# Altium project ArduinoZeroV4.0.PrjPcb
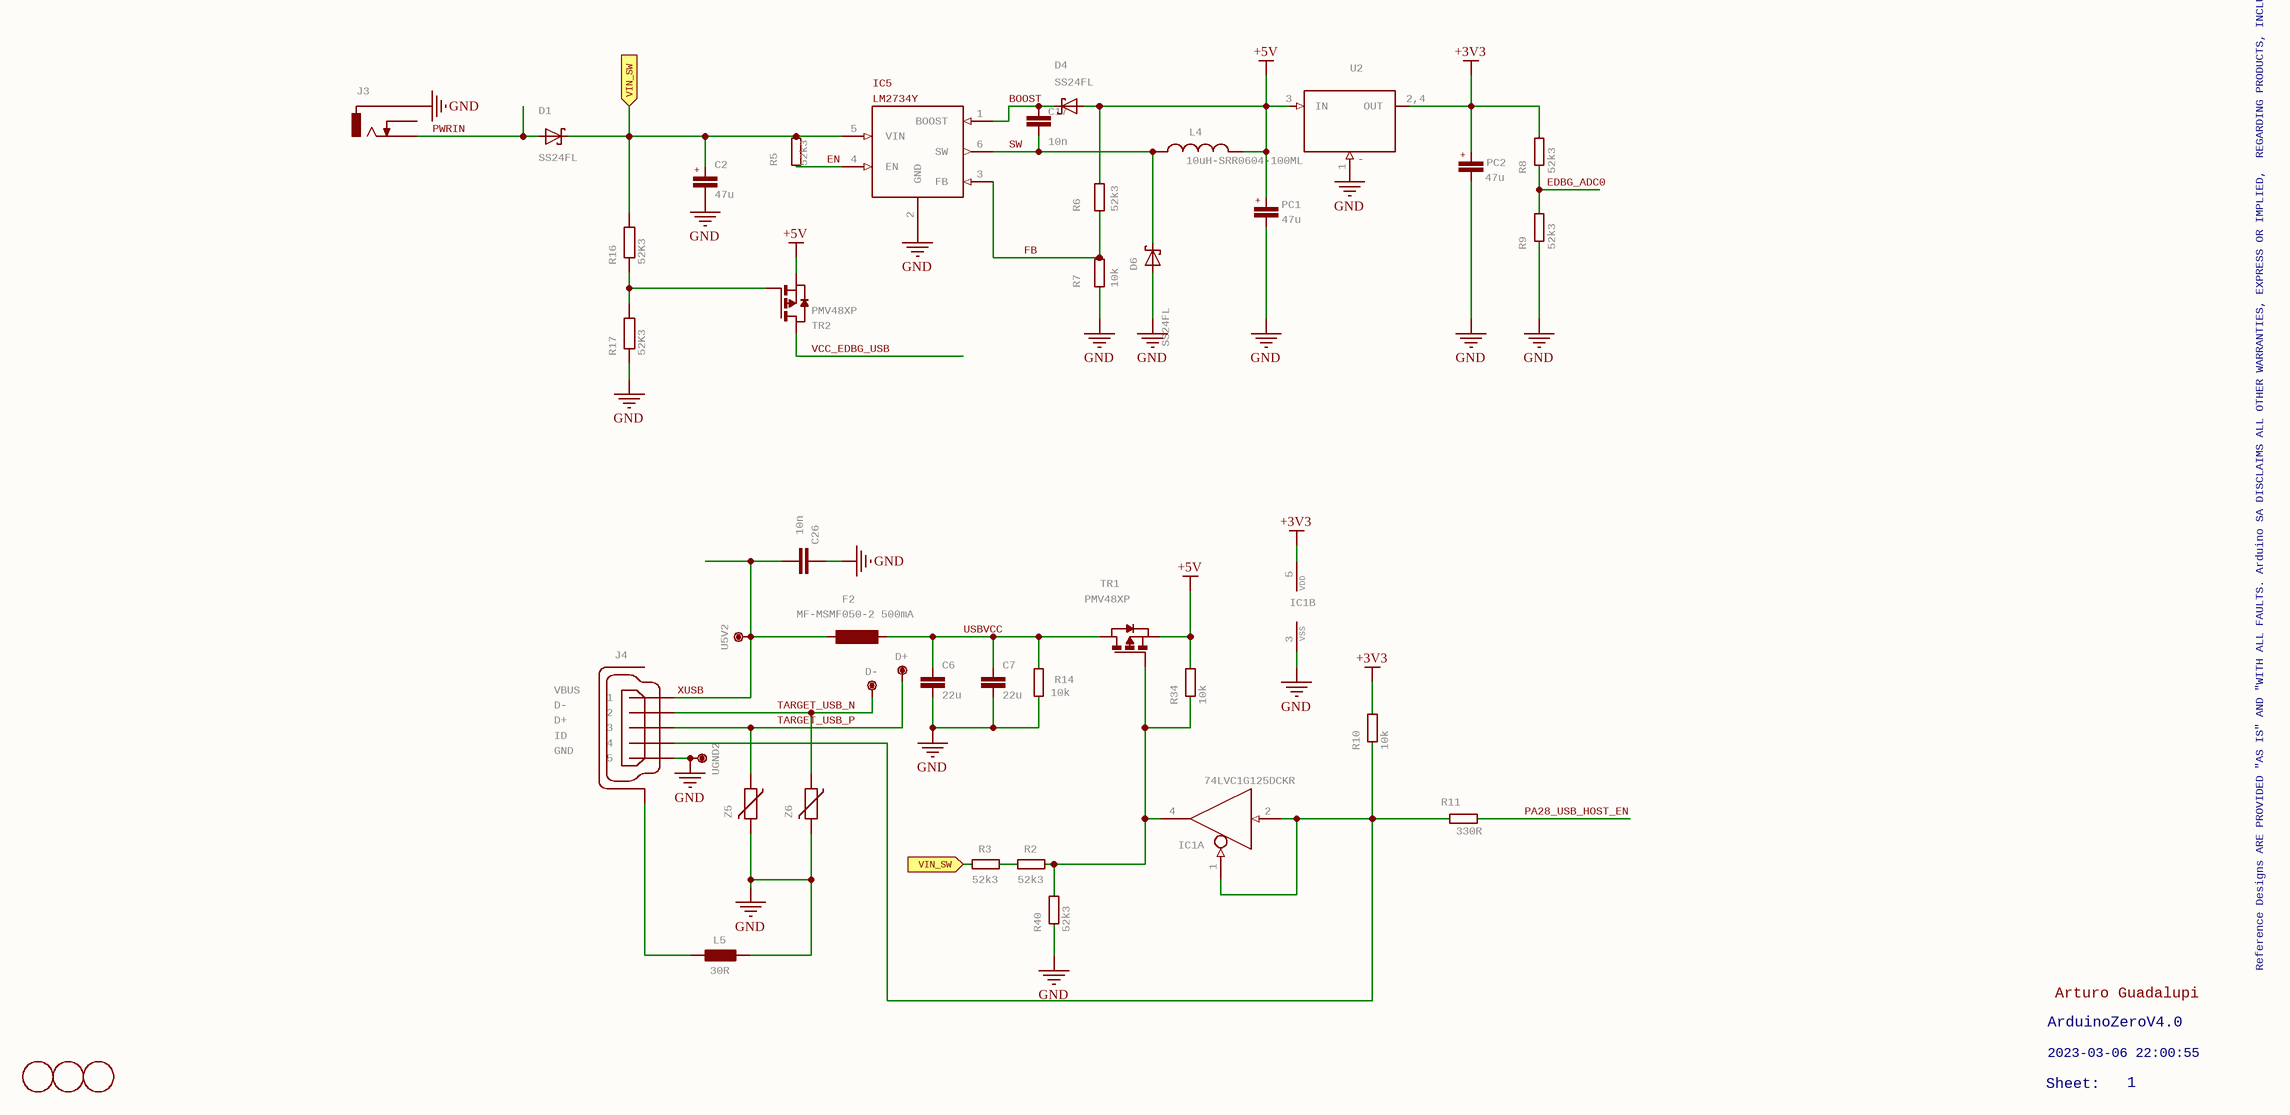
[diagram p0: ArduinoZeroV4.0_0.SchDoc]
2 sheets, 72 parts. Net scope: flat (ports and power ports of the same name join across sheets).
Board file: ArduinoZeroV4.0.PcbDoc
Sheets:
  ArduinoZeroV4.0_0.SchDoc
  ArduinoZeroV4.0_1.SchDoc

## Sheet ArduinoZeroV4.0_0.SchDoc: ArduinoZeroV4.0
size 409 x 289 mm; Origin: Eagle; Date: 2023-03-06 22:00:55; SheetNumber: 1; CODE-ARDUINO: DNP; DATASHEET: DNP; DISTRIBUTOR-LINK: DNP; DISTRIBUTOR-PN: DNP; MANUFACTURER: DNP; MANUFACTURER-PN: DNP; NOTE: DNP; Value: DNP; GateName_1: G$1; SymbolName_1: A3L-LOC; LibraryName: Arduino-utility; DeviceSetName: A3-FRAME; Sheet: Sheet:; ReferenceDesignsAREPROVIDED"ASIS"AND"WITHALLFAULTS.ArduinoSADISCLAIMSALLOTHERWARRANTIES,EXPRESSORIMPLIED,
REGARDINGPRODUCTS,INCLUDINGBUTNOTLIMITEDTO,ANYIMPLIEDWARRANTIESOFMERCHANTABILITYORFITNESSFORAPARTICULARPURPOSE

ArduinoSAmaymakechangestospecificationsandproductdescriptionsatanytime,withoutnotice.TheCustomermustnot
relyontheabsenceorcharacteristicsofanyfeaturesorinstructionsmarked"reserved"or"undefined."ArduinoSAreserves
theseforfuturedefinitionandshallhavenoresponsibilitywhatsoeverforconflictsorincompatibilitiesarisingfromfuturechangestothem.
TheproductinformationontheWebSiteorMaterialsissubjecttochangewithoutnotice.Donotfinalizeadesignwiththisinfo

ARDUINOandotherArduinobrandsandlogosandTrademarksofArduinoSA.AllArduinoSATrademarkscannotbeusedwithoutowner'sformalpermission: Reference Designs ARE PROVIDED "AS IS" AND "WITH ALL FAULTS. Arduino SA DISCLAIMS ALL OTHER WARRANTIES, EXPRESS OR IMPLIED, / REGARDING PRODUCTS, INCLUDING BUT NOT LIMITED TO, ANY IMPLIED WARRANTIES OF MERCHANTABILITY OR FITNESS FOR A PARTICULAR PURPOSE / Arduino SA may make changes to specifications and product descriptions at any time, without notice. The Customer must not / rely on the absence or characteristics of any features or instructions marked "reserved" or "undefined." Arduino SA reserves / these for future definition and shall have no responsibility whatsoever for conflicts or incompatibilities arising from future changes to them. / The product information on the Web Site or Materials is subject to change without notice. Do not finalize a design with this info / ARDUINO and other Arduino brands and logos and Trademarks of Arduino SA. All Arduino SA Trademarks cannot be used without owner's formal permission

### Parts
C2  47u  [PANASONIC_D]
C6  22u  [0805-R2013X50N]
C7  22u  [0805-R2013X50N]
C17  10n  [0603-1608X90N]
C26  10n  [C0603-ROUND]
D1  SS24FL  [SOD123F]
D4  SS24FL  [SOD123F]
D6  SS24FL  [SOD123F]
D+  DNP  [TP-1.00MM]  (value not drawn)
D-  DNP  [TP-1.00MM]  (value not drawn)
F2  MF-MSMF050-2 500mA  [L1812]
FD1  DNP  [FD-1-1.5]  (value not drawn)
FD2  DNP  [FD-1-1.5]  (value not drawn)
FD3  DNP  [FD-1-1.5]  (value not drawn)
IC1  74LVC1G125DCKR  [SC70-5]  (parts A,B of 2)
IC5  LM2734Y  [SOT23-6]
J3  -  [POWERSUPPLY_DC-21MM]  (value not drawn)
J4  -  [ZX62-AB-5PA]  (value not drawn)
L4  10uH-SRR0604-100ML  [SRR0604]
L5  30R  [0805-R2013X50N]
PC1  47u  [PANASONIC_D]
PC2  47u  [PANASONIC_D]
R2  52k3  [C0603]
R3  52k3  [C0603]
R5  52k3  [C0603]
R6  52k3  [C0603]
R7  10k  [C0603]
R8  52k3  [C0603]
R9  52k3  [C0603]
R10  10k  [C0603]
R11  330R  [C0603]
R14  10k  [C0603]
R16  52K3  [R0603-ROUND]
R17  52K3  [R0603-ROUND]
R34  10k  [C0603]
R40  52k3  [C0603]
TR1  PMV48XP  [SOT-23]
TR2  PMV48XP  [SOT-23]
U2  -  [SOT223]
U5V2  DNP  [TP-1.00MM]  (value not drawn)
UGND2  DNP  [TP-1.00MM]  (value not drawn)
Z5  -  [C0603]  (value not drawn)
Z6  -  [C0603]  (value not drawn)

### Ports
VIN_SW (in)

### Nets
+3V3: IC1.5(VDD) PC2.+ R8.2 R10.2 U2.2,4(OUT)
+5V: D4.A L4.P$2 PC1.+ R6.1 R34.2 TR1.2(S) TR2.2(S) U2.3(IN)
GND: C2.- C6.2 C7.2 C26.2 D6.A IC1.3(VSS) IC5.2(GND) J3.-1-3 J4.5 L5.2 PC1.- PC2.- R7.2 R9.1 R14.1 R17.1 R40.1 U2.1(GND/ADJ) UGND2.X(P$1) Z5.2 Z6.2
BOOST: C17.1 D4.C IC5.1(BOOST)
EDBG_ADC0: R8.1 R9.2
EN: IC5.4(EN) R5.2
FB: IC5.3(FB) R6.2 R7.1
PA28_USB_HOST_EN: R11.2
PWRIN: D1.A J3.+1-3
SW: C17.2 D6.C IC5.6(SW) L4.P$1
TARGET_USB_N: D-.X(P$1) J4.2 Z6.1
TARGET_USB_P: D+.X(P$1) J4.3 Z5.1
USBVCC: C6.1 C7.1 F2.1 R14.2 TR1.1(D)
VCC_EDBG_USB: TR2.1(D)
XUSB: C26.1 F2.2 J4.1 U5V2.X(P$1)
NetC2_+: C2.+ D1.C IC5.5(VIN) R3.1 R5.1 R16.2 ; port VIN_SW
NetIC1_1: IC1.1(OE) IC1.2(I) J4.4 R10.1 R11.1
NetIC1_4: IC1.4(O) R2.2 R34.1 R40.2 TR1.3(G)
NetJ4_6-11: J4.6-11(SH) L5.1
NetR2_1: R2.1 R3.2
NetR16_1: R16.1 R17.2 TR2.3(G)

Not connected (* = marked no-connect by the designer): J3 E1-3(2)

### Notes on the sheet
- Reference Designs ARE PROVIDED "AS IS" AND "WITH ALL FAULTS. Arduino SA DISCLAIMS ALL OTHER WARRANTIES, EXPRESS OR IMPLIED,
  REGARDING PRODUCTS, INCLUDING BUT NOT LIMITED TO, ANY IMPLIED WARRANTIES OF MERCHANTABILITY OR FITNESS FOR A PARTICULAR PURPOSE
  Arduino SA may make changes to specifications and product descriptions at any time, without notice. The Customer must not
  rely on the absence or characteristics of any features or instructions marked "reserved" or "undefined." Arduino SA reserves
  these for future definition and shall have no responsibility whatsoever for conflicts or incompatibilities arising from future changes to them.
  The product information on the Web Site or Materials is subject to change without notice. Do not finalize a design with this info
  ARDUINO and other Arduino brands and logos and Trademarks of Arduino SA. All Arduino SA Trademarks cannot be used without owner's formal permission
- ArduinoZeroV4.0
- Arturo Guadalupi
- Sheet:
- 2023-03-06 22:00:55
- 1

### Library data of the parts
C2 PC1 PC2 = C+PAN-D: Polarized Capacitor; MANUFACTURER: Panasonic; MANUFACTURER-PN: EEE-1EA470WP; GateName_1: G$1; SymbolName_1: C+; DeviceName: PAN-D; CODE-ARDUINO: 0113; PN-ALTERNATIVE1: TS13C01E470MET000R; LibraryName: Arduino-rcl; DeviceSetName: C+; +: +; DATASHEET: https://industrial.panasonic.com/cdbs/www-data/pdf/RDE0000/DME0000COL90.pdf; DISTRIBUTOR-LINK: https://www.digikey.com/product-detail/en/panasonic-electronic-components/EEE-1EA470WP/PCE3908CT-ND/766284; DISTRIBUTOR-PN: PCE3908CT-ND
C6 C7 = C-0805: SMD Capacitor; MANUFACTURER: Samsung; MANUFACTURER-PN: CL21A226MQCLQNC; GateName_1: G$1; SymbolName_1: C; DeviceName: -0805; CODE-ARDUINO: 2233; LibraryName: Arduino-rcl; DeviceSetName: C; DATASHEET: https://media.digikey.com/pdf/Data%20Sheets/Samsung%20PDFs/CL21A226MQCLQNC_character.pdf; DISTRIBUTOR-LINK: https://www.digikey.com/product-detail/en/samsung-electro-mechanics-america-inc/CL21A226MQCLQNC/1276-2412-1-ND/3890498; DISTRIBUTOR-PN: 1276-2412-1-ND; NOTE: -
C17 = C-0603: SMD Capacitor; MANUFACTURER: Murata; MANUFACTURER-PN: GRM188R71H103KA01D; GateName_1: G$1; SymbolName_1: C; DeviceName: -0603; CODE-ARDUINO: 0142; LibraryName: Arduino-rcl; DeviceSetName: C; DATASHEET: http://www.murata.com/~/media/webrenewal/support/library/catalog/products/capacitor/mlcc/c02e.pdf; DISTRIBUTOR-LINK: https://www.digikey.com/product-detail/en/murata-electronics-north-america/GRM188R71H103KA01D/490-1512-1-ND/587862; DISTRIBUTOR-PN: 490-1512-1-ND; NOTE: -; PN-ALTERNATIVE1: PN-ALTERNATIVE1; PN-ALTERNATIVE2: PN-ALTERNATIVE2; PN-ALTERNATIVE3: PN-ALTERNATIVE3; PN-ALTERNATIVE4: PN-ALTERNATIVE4; PN-ALTERNATIVE5: PN-ALTERNATIVE5
C26 = 0142_10NF_0603: 10nF 0603; GateName_1: G$1; SymbolName_1: C-EU; MONTHLY_USAGE: _____; TYPE: Condensatori; LibraryName: Condensatori; DeviceSetName: 0142_10NF_0603; CASE: 0603; PART_NUMBER: 10nF_0603; PRICE: _____; SUPPLIER: _____
D1 D4 D6 = SS24FL: Schottky diode; MANUFACTURER: Fairchild; GateName_1: G$1; SymbolName_1: SCHOTTKY-1; CODE-ARDUINO: 0025; LibraryName: Arduino-diodes; DeviceSetName: SS24FL; DATASHEET: https://www.fairchildsemi.com/datasheets/SS/SS24FL.pdf; DISTRIBUTOR-LINK: https://www.digikey.com/product-detail/en/fairchild-on-semiconductor/SS24FL/SS24FLCT-ND/5305093; DISTRIBUTOR-PN: SS24FLCT-ND; MANUFACTURER-PN: SS24FL
D+ D- U5V2 UGND2 = TPTP-1.00MM: Testpoint; GateName_1: G$1; DeviceSetName: TP; SymbolName_1: TESTPOINT; DeviceName: TP-1.00MM; LibraryName: Arduino-utility; CODE-ARDUINO: DNP; DATASHEET: DNP; DISTRIBUTOR-LINK: DNP; DISTRIBUTOR-PN: DNP; MANUFACTURER: DNP; MANUFACTURER-PN: DNP
F2 = 0002_MF-MSMF050-2: 500 mA Multifuse ï¿½ Polyfuse; GateName_1: G$1; SymbolName_1: L-EU; MONTHLY_USAGE: _____; TYPE: Protezione; LibraryName: Protezione; DeviceSetName: 0002_MF-MSMF050-2; CASE: CASE; PART_NUMBER: MF-MSMF050-2; PRICE: _____; SUPPLIER: _____
FD1-FD3 = FIDUCIAL-1.5MM: Fiducial mount; GateName_1: G$1; SymbolName_1: ARDUINO_FIDUCIAL; DeviceName: -1.5MM; LibraryName: Arduino-utility; DeviceSetName: FIDUCIAL; CODE-ARDUINO: DNP; DATASHEET: DNP; DISTRIBUTOR-LINK: DNP; DISTRIBUTOR-PN: DNP; MANUFACTURER: DNP; MANUFACTURER-PN: DNP
IC1 = SN74LVC1G125DCKR: Single bus buffer with 3-state output; MANUFACTURER: Texas Instruments; GateName_1: A; SymbolName_1: 74125; GateName_2: P; SymbolName_2: PWRN-2; CODE-ARDUINO: 0040; NOTE: NO; LibraryName: Arduino-ICs; DeviceSetName: SN74LVC1G125DCKR; DATASHEET: http://www.ti.com/lit/ds/symlink/sn74lvc1g125.pdf; DISTRIBUTOR-LINK: https://www.digikey.com/product-detail/en/texas-instruments/SN74LVC1G125DCKR/296-11604-1-ND/385743; DISTRIBUTOR-PN: 296-11604-1-ND; MANUFACTURER-PN: SN74LVC1G125DCKR
IC5 = 0179_LM2734YMK: 1A Load Step-Down DC-DC Regulator - LM2734Y   Switching; GateName_1: G$1; SymbolName_1: LM2736; MONTHLY_USAGE: _____; LibraryName: Circuito Integrato; DeviceSetName: 0179_LM2734YMK; CASE: SOT23-5; PART_NUMBER: LM2734YMK; PRICE: _____; SUPPLIER: _____; TYPE: Circuito_Integrato
J3 = BARRELLG: Power Barrel Connector Jack 2.10mm ID (0.083"), 5.50mm OD (0.217") Through Hole, Right Angle; MANUFACTURER: Kobiconn; MANUFACTURER-PN: 163-179PH-EX; GateName_1: G$1; SymbolName_1: DC-JACK-SWITCH; DeviceName: LG; CODE-ARDUINO: 0018; LibraryName: Arduino-connectors; DeviceSetName: BARREL; DATASHEET: http://www.mouser.com/ds/2/253/KC-301287-195995.pdf; DISTRIBUTOR-LINK: https://www.mouser.it/ProductDetail/Kobiconn/163-179PH-EX/?qs=Xb8IjHhkxj5l2UOaIqcGCw==; DISTRIBUTOR-PN: 163-179PH-EX
J4 = USB-MICRO: USB - micro AB USB 2.0 Receptacle Connector 5 Position Surface Mount, Right Angle, Horizontal; MANUFACTURER: Hirose; MANUFACTURER-PN: ZX62-AB-5PA(31); GateName_1: G$1; CODE-ARDUINO: 2219; SymbolName_1: USB-MICRO; LibraryName: Arduino-connectors; DeviceSetName: USB-MICRO; VBUS: VBUS; D-: D-; D+: D+; ID: ID; GND: GND; DATASHEET: https://www.hirose.com/product/en/download_file/key_name/ZX/category/Catalog/doc_file_id/31704/?file_category_id=4&item_id=13&is_series=1; DISTRIBUTOR-LINK: http://www.digikey.com/product-detail/en/hirose-electric-co-ltd/ZX62-AB-5PA(31)/H125279CT-ND/5994741; DISTRIBUTOR-PN: H125279CT-ND
L4 = 0031_SRR0604-100ML: SRR0604-100ML; GateName_1: G$1; SymbolName_1: L-US; MONTHLY_USAGE: _____; TYPE: Induttanze; LibraryName: Induttanze; DeviceSetName: 0031_SRR0604-100ML; CASE: SMD_6,5x6,5; PART_NUMBER: SRR0604-100ML; PRICE: _____; SUPPLIER: _____
L5 = FERRITE0805: SMD ferrite; MANUFACTURER: Samsung; MANUFACTURER-PN: CIB21P300NE; GateName_1: >NAME; DeviceName: 0805; CODE-ARDUINO: 0001; SymbolName_1: FERRITE; LibraryName: Arduino-rcl; DeviceSetName: FERRITE; DATASHEET: https://media.digikey.com/pdf/Data%20Sheets/Samsung%20PDFs/Chip_Inductor_Catalog_2014.pdf; DISTRIBUTOR-LINK: https://www.digikey.com/products/en?keywords=CIB21P300NE; DISTRIBUTOR-PN: CIB21P300NE-ND; PN-ALTERNATIVE1: PN-ALTERNATIVE1
R2 R3 R5-R9 R40 = R-0603: SMD Resistor; MANUFACTURER: Yageo; MANUFACTURER-PN: RC0603FR-0752K3L; GateName_1: G$1; SymbolName_1: R; DeviceName: -0603; CODE-ARDUINO: A5459; NOTE: 1% ONLY; LibraryName: Arduino-rcl; DeviceSetName: R; DATASHEET: https://industrial.panasonic.com/cdbs/www-data/pdf/RDA0000/AOA0000C304.pdf; DISTRIBUTOR-LINK: https://www.digikey.com/product-detail/en/yageo/RC0603FR-0752K3L/311-52.3KHRCT-ND/730237; DISTRIBUTOR-PN: 311-52.3KHRCT-ND; PN-ALTERNATIVE1: -
R10 R14 R34 = R-0603: SMD Resistor; MANUFACTURER: Yageo; MANUFACTURER-PN: RC0603JR-0710KL; GateName_1: G$1; SymbolName_1: R; DeviceName: -0603; CODE-ARDUINO: 0028; NOTE: NO; LibraryName: Arduino-rcl; DeviceSetName: R; DATASHEET: http://www.yageo.com/documents/recent/PYu-RC_Group_51_RoHS_L_8.pdf; DISTRIBUTOR-LINK: https://www.digikey.com/product-detail/en/yageo/RC0603JR-0710KL/311-10KGRCT-ND/729647; DISTRIBUTOR-PN: 311-10KGRCT-ND; PN-ALTERNATIVE1: -
R11 = R-0603: SMD Resistor; MANUFACTURER: Yageo; MANUFACTURER-PN: RC0603FR-07330RL; GateName_1: G$1; SymbolName_1: R; DeviceName: -0603; CODE-ARDUINO: 0049; NOTE: NO; LibraryName: Arduino-rcl; DeviceSetName: R; DATASHEET: http://www.yageo.com/documents/recent/PYu-RC_Group_51_RoHS_L_10.pdf; DISTRIBUTOR-LINK: https://www.digikey.com/product-detail/en/yageo/RC0603FR-07330RL/311-330HRCT-ND/730109; DISTRIBUTOR-PN: 311-330HRCT-ND; PN-ALTERNATIVE1: -
R16 R17 = 0180_52K3_0603: 52k3 0603; GateName_1: G$1; SymbolName_1: R-EU; MONTHLY_USAGE: _____; LibraryName: Resistenze; DeviceSetName: 0180_52K3_0603; CASE: 0603; PART_NUMBER: 52k3_0603; PRICE: _____; SUPPLIER: _____; TYPE: Resistenze
TR1 TR2 = PMV48XP: 20 V, 3.5 A P-channel Trench MOSFET - PMV48XP; MANUFACTURER: Nexperia; MANUFACTURER-PN: PMV48XP,215; SymbolName_1: P_MOSFET; CODE-ARDUINO: 1039; PN-ALTERNATIVE: FDN340P; PN-ALTERNATIVE2: IRLML6402TRPBF; GateName_1: A; LibraryName: Arduino-transistors; DeviceSetName: PMV48XP; DATASHEET: https://assets.nexperia.com/documents/data-sheet/PMV48XP.pdf; DISTRIBUTOR-LINK: https://www.digikey.com/product-detail/en/nexperia-usa-inc/PMV48XP215/1727-5907-1-ND/2744665; DISTRIBUTOR-PN: 1727-5907-1-ND
U2 = LDOSOT223: LDO; MANUFACTURER: NXP; MANUFACTURER-PN: NX1117CE33Z,115; GateName_1: G$1; SymbolName_1: LINEAR_3PINS; CODE-ARDUINO: 0045; NOTE: NO; DeviceName: SOT223; LibraryName: Arduino-ICs; DeviceSetName: LDO; DATASHEET: https://media.digikey.com/pdf/Data%20Sheets/NXP%20PDFs/NX1117C(E).pdf; DISTRIBUTOR-LINK: https://www.digikey.com/product-detail/en/nxp-usa-inc/NX1117CE33Z,115/568-8443-1-ND/2765160; DISTRIBUTOR-PN: 568-8443-1-ND
Z5 Z6 = VARISTOR: Varistors; MANUFACTURER: Bourns; GateName_1: A; CODE-ARDUINO: 0010; CODE-TK2: CG0603MLC-05E; NOTE: NO; SymbolName_1: VARISTOR; LibraryName: Arduino-rcl; DeviceSetName: VARISTOR; DATASHEET: http://www.bourns.com/data/global/pdfs/MLC.pdf; DISTRIBUTOR-LINK: https://www.digikey.com/product-detail/it/bourns-inc/CG0603MLC-05E/CG0603MLC-05ECT-ND/3438061; DISTRIBUTOR-PN: CG0603MLC-05ETR-ND; MANUFACTURER-PN: CG0603MLC-05E

## Sheet ArduinoZeroV4.0_1.SchDoc: ArduinoZeroV4.0
size 409 x 289 mm; Origin: Eagle; Date: 2023-03-06 22:00:55; SheetNumber: 2; CODE-ARDUINO: DNP; DATASHEET: DNP; DISTRIBUTOR-LINK: DNP; DISTRIBUTOR-PN: DNP; MANUFACTURER: DNP; MANUFACTURER-PN: DNP; NOTE: DNP; Value: DNP; GateName_1: G$1; SymbolName_1: A3L-LOC; LibraryName: Arduino-utility; DeviceSetName: A3-FRAME; Sheet: Sheet:; ReferenceDesignsAREPROVIDED"ASIS"AND"WITHALLFAULTS.ArduinoSADISCLAIMSALLOTHERWARRANTIES,EXPRESSORIMPLIED,
REGARDINGPRODUCTS,INCLUDINGBUTNOTLIMITEDTO,ANYIMPLIEDWARRANTIESOFMERCHANTABILITYORFITNESSFORAPARTICULARPURPOSE

ArduinoSAmaymakechangestospecificationsandproductdescriptionsatanytime,withoutnotice.TheCustomermustnot
relyontheabsenceorcharacteristicsofanyfeaturesorinstructionsmarked"reserved"or"undefined."ArduinoSAreserves
theseforfuturedefinitionandshallhavenoresponsibilitywhatsoeverforconflictsorincompatibilitiesarisingfromfuturechangestothem.
TheproductinformationontheWebSiteorMaterialsissubjecttochangewithoutnotice.Donotfinalizeadesignwiththisinfo

ARDUINOandotherArduinobrandsandlogosandTrademarksofArduinoSA.AllArduinoSATrademarkscannotbeusedwithoutowner'sformalpermission: Reference Designs ARE PROVIDED "AS IS" AND "WITH ALL FAULTS. Arduino SA DISCLAIMS ALL OTHER WARRANTIES, EXPRESS OR IMPLIED, / REGARDING PRODUCTS, INCLUDING BUT NOT LIMITED TO, ANY IMPLIED WARRANTIES OF MERCHANTABILITY OR FITNESS FOR A PARTICULAR PURPOSE / Arduino SA may make changes to specifications and product descriptions at any time, without notice. The Customer must not / rely on the absence or characteristics of any features or instructions marked "reserved" or "undefined." Arduino SA reserves / these for future definition and shall have no responsibility whatsoever for conflicts or incompatibilities arising from future changes to them. / The product information on the Web Site or Materials is subject to change without notice. Do not finalize a design with this info / ARDUINO and other Arduino brands and logos and Trademarks of Arduino SA. All Arduino SA Trademarks cannot be used without owner's formal permission
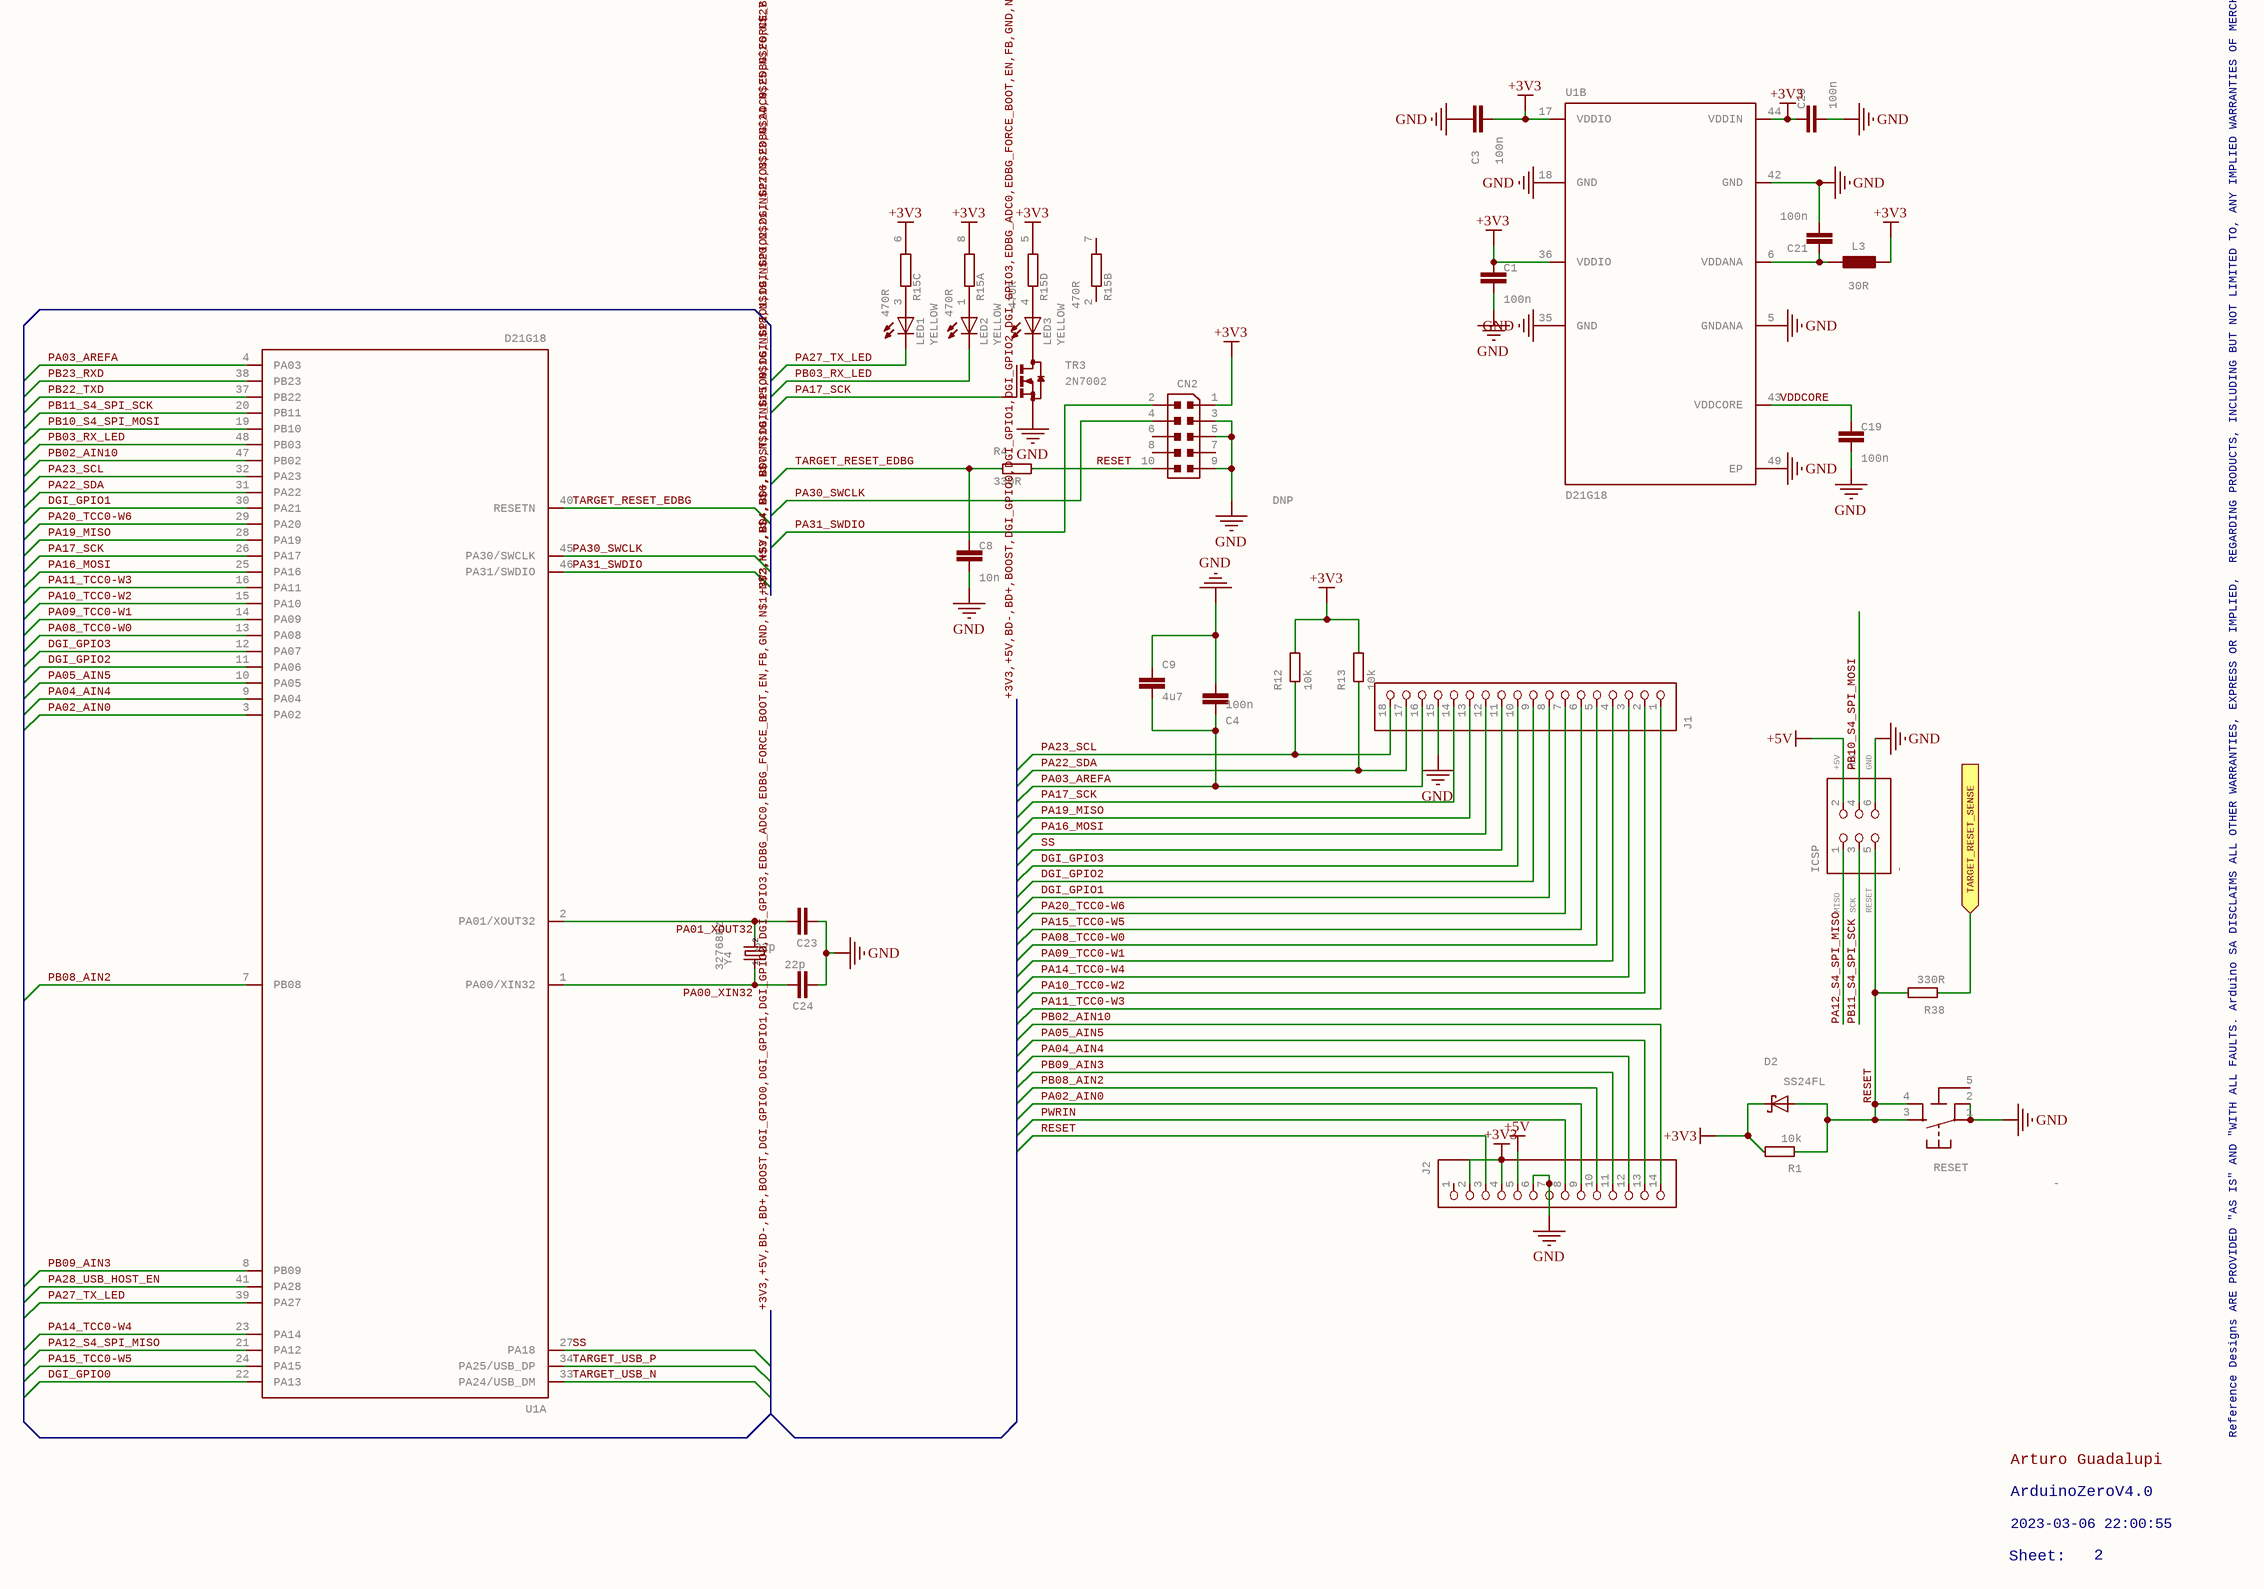
[diagram p1: ArduinoZeroV4.0_1.SchDoc]

### Parts
C1  100n  [0603-1608X90N]
C3  100n  [0603-1608X90N]
C4  100n  [0402-1005X55N]
C8  10n  [0603-1608X90N]
C9  4u7  [0603-1608X90N]
C19  100n  [0603-1608X90N]
C20  100n  [0603-1608X90N]
C21  100n  [0603-1608X90N]
C23  22p  [0603-1608X90N]
C24  22p  [0603-1608X90N]
CN2  DNP  [PINHEAD_2X05_127]
D2  SS24FL  [SOD123F]
ICSP  -  [2X03]
J1  -  [1X18-CUSTOM]  (value not drawn)
J2  -  [1X14-CUSTOM]  (value not drawn)
L3  30R  [0805-R2013X50N]
LED1  YELLOW  [CHIPLED_0805]
LED2  YELLOW  [CHIPLED_0805]
LED3  YELLOW  [CHIPLED_0805]
R1  10k  [C0603]
R4  330R  [C0603]
R12  10k  [C0603]
R13  10k  [C0603]
R15  470R  [CAY16]  (parts A,B,C,D of 4)
R38  330R  [C0603]
RESET  -  [TS42]
TR3  2N7002  [SOT23]
U1  D21G18  [QFN50P700X700X90-49XN-EPSQ515]  (parts A,B of 2)
Y4  32768Hz  [ABS07]

### Ports
TARGET_RESET_SENSE (in)

### Nets
+3V3: C1.1 C3.2 C20.1 CN2.1 D2.C J2.2 J2.4 L3.2 R1.2 R12.2 R13.2 R15.5 R15.6 R15.8 U1.17(VDDIO) U1.36(VDDIO) U1.44(VDDIN)
+5V: ICSP.2 J2.5
GND: C1.2 C3.1 C4.2 C8.2 C9.1 C19.2 C20.2 C21.2 C23.1 C24.1 CN2.3 CN2.5 CN2.9 ICSP.6 J1.15 J2.6 J2.7 RESET.1 RESET.2 TR3.2(S) U1.5(GNDANA) U1.18(GND) U1.35(GND) U1.42(GND) U1.49(EP)
DGI_GPIO0: U1.22(PA13)
DGI_GPIO1: J1.8 U1.30(PA21)
DGI_GPIO2: J1.9 U1.11(PA06)
DGI_GPIO3: J1.10 U1.12(PA07)
PA00_XIN32: C24.2 U1.1(PA00/XIN32) Y4.1
PA01_XOUT32: C23.2 U1.2(PA01/XOUT32) Y4.2
PA02_AIN0: J2.9 U1.3(PA02)
PA03_AREFA: C4.1 C9.2 J1.16 U1.4(PA03)
PA04_AIN4: J2.12 U1.9(PA04)
PA05_AIN5: J2.13 U1.10(PA05)
PA08_TCC0-W0: J1.5 U1.13(PA08)
PA09_TCC0-W1: J1.4 U1.14(PA09)
PA10_TCC0-W2: J1.2 U1.15(PA10)
PA11_TCC0-W3: J1.1 U1.16(PA11)
PA12_S4_SPI_MISO: ICSP.1 U1.21(PA12)
PA14_TCC0-W4: J1.3 U1.23(PA14)
PA15_TCC0-W5: J1.6 U1.24(PA15)
PA16_MOSI: J1.12 U1.25(PA16)
PA17_SCK: J1.14 TR3.1(G) U1.26(PA17)
PA19_MISO: J1.13 U1.28(PA19)
PA20_TCC0-W6: J1.7 U1.29(PA20)
PA22_SDA: J1.17 R13.1 U1.31(PA22)
PA23_SCL: J1.18 R12.1 U1.32(PA23)
PA27_TX_LED: LED1.C U1.39(PA27)
PA28_USB_HOST_EN: U1.41(PA28)
PA30_SWCLK: CN2.4 U1.45(PA30/SWCLK)
PA31_SWDIO: CN2.2 U1.46(PA31/SWDIO)
PB02_AIN10: J2.14 U1.47(PB02)
PB03_RX_LED: LED2.C U1.48(PB03)
PB08_AIN2: J2.10 U1.7(PB08)
PB09_AIN3: J2.11 U1.8(PB09)
PB10_S4_SPI_MOSI: ICSP.4 U1.19(PB10)
PB11_S4_SPI_SCK: ICSP.3 U1.20(PB11)
PB22_TXD: U1.37(PB22)
PB23_RXD: U1.38(PB23)
PWRIN: J2.8
RESET: CN2.10 D2.A ICSP.5 J2.3 R1.1 R4.2 R38.2 RESET.3 RESET.4
SS: J1.11 U1.27(PA18)
TARGET_RESET_EDBG: C8.1 R4.1 U1.40(RESETN)
TARGET_USB_N: U1.33(PA24/USB_DM)
TARGET_USB_P: U1.34(PA25/USB_DP)
VDDCORE: C19.1 U1.43(VDDCORE)
NetC21_1: C21.1 L3.1 U1.6(VDDANA)
NetLED1_A: LED1.A R15.3
NetLED2_A: LED2.A R15.1
NetLED3_A: LED3.A R15.4
NetLED3_C: LED3.C TR3.3(D)
NetR38_1: R38.1 ; port TARGET_RESET_SENSE

Not connected (* = marked no-connect by the designer): CN2 6 7 8; J2 1; R15 2(1) 7(2); RESET 5(5-GND)

### Buses and harness runs
bus +3V3,+5V,BD-,BD+,BOOST,DGI_GPIO0,DGI_GPIO1,DGI_GPIO2,DGI_GPIO3,EDBG_ADC0,EDBG_FORCE_BOOT,EN,FB,GND,N$1,N$2,N$3,N$4,N$6,N$7,N$10,N$15,N$16,N$18,N$19,N$20,N$21,N$22,N$23,N$24,N$25,N$26,N$27,N$34,N$37,N$38,N$39,N$40,N$41,N$42,N$43,N$44,N$45,N$57,N$58,N$59,N$60,N$61,N$67,N$68,PA00_XIN32,PA01_XOUT32,PA02_AIN0,PA03_AREFA,PA04_AIN4,PA05_AIN5,PA08_TCC0-W0,PA09_TCC0-W1,PA10_TCC0-W2,PA11_TCC0-W3,PA12_S4_SPI_MISO,PA14_TCC0-W4,PA15_TCC0-W5,PA16_MOSI,PA17_SCK,PA19_MISO,PA20_TCC0-W6,PA22_SDA,PA23_SCL,PA27_TX_LED,PA28_USB_HOST_EN,PA30_SWCLK,PA31_SWDIO,PB02_AIN10,PB03_RX_LED,PB08_AIN2,PB09_AIN3,PB10_S4_SPI_MOSI,PB11_S4_SPI_SCK,PB22_TXD,PB23_RXD,POWER_LED_CTRL,PWRIN,RESET,SS,STATUS_LED_CTRL,SW,TARGET_RESET_EDBG,TARGET_RESET_SENSE,TARGET_USB_N,TARGET_USB_P,USBVCC,VCC_EDBG_3V3,VCC_EDBG_USB,VDDCORE,VIN_SW,XUSB,XVCC

### Notes on the sheet
- Reference Designs ARE PROVIDED "AS IS" AND "WITH ALL FAULTS. Arduino SA DISCLAIMS ALL OTHER WARRANTIES, EXPRESS OR IMPLIED,
  REGARDING PRODUCTS, INCLUDING BUT NOT LIMITED TO, ANY IMPLIED WARRANTIES OF MERCHANTABILITY OR FITNESS FOR A PARTICULAR PURPOSE
  Arduino SA may make changes to specifications and product descriptions at any time, without notice. The Customer must not
  rely on the absence or characteristics of any features or instructions marked "reserved" or "undefined." Arduino SA reserves
  these for future definition and shall have no responsibility whatsoever for conflicts or incompatibilities arising from future changes to them.
  The product information on the Web Site or Materials is subject to change without notice. Do not finalize a design with this info
  ARDUINO and other Arduino brands and logos and Trademarks of Arduino SA. All Arduino SA Trademarks cannot be used without owner's formal permission
- Arturo Guadalupi
- ArduinoZeroV4.0
- Sheet:
- 2023-03-06 22:00:55
- 2

### Library data of the parts
C1 C3 C19-C21 = C-0603: SMD Capacitor; MANUFACTURER: Murata; MANUFACTURER-PN: GRM188R71C104KA01D; GateName_1: G$1; SymbolName_1: C; DeviceName: -0603; CODE-ARDUINO: 0015; PN-ALTERNATIVE1: NMC0603Y5V104Z25TRPF; PN-ALTERNATIVE2: C1608F104Z500NT; PN-ALTERNATIVE3: C0603C104K3RAC7411; PN-ALTERNATIVE4: 06035D104KAT2A; PN-ALTERNATIVE5: 0603B104K500CT; LibraryName: Arduino-rcl; DeviceSetName: C; DATASHEET: http://search.murata.co.jp/Ceramy/image/img/A01X/G101/ENG/GRM188R71C104KA01-01.pdf; DISTRIBUTOR-LINK: https://www.digikey.com/product-detail/en/murata-electronics-north-america/GRM188R71C104KA01D/490-1532-1-ND/587771; DISTRIBUTOR-PN: 490-1532-2-ND; NOTE: -
C4 = C-0402: SMD Capacitor; MANUFACTURER: TDK; MANUFACTURER-PN: C1005X5R1H104K050BB; GateName_1: G$1; SymbolName_1: C; DeviceName: -0402; CODE-ARDUINO: 0132; LibraryName: Arduino-rcl; DeviceSetName: C; DATASHEET: http://www.tdk.com/pdf/TDKMLCCCapRange.pdf; DISTRIBUTOR-LINK: http://www.digikey.com/product-detail/en/tdk-corporation/C1005X5R1H104K050BB/445-5942-1-ND/2443982; DISTRIBUTOR-PN: 445-5942-1-ND; NOTE: -
C8 = C-0603: as C17 on sheet ArduinoZeroV4.0_0; LibraryName: Arduino-rcl; DeviceSetName: C; DATASHEET: http://www.murata.com/~/media/webrenewal/support/library/catalog/products/capacitor/mlcc/c02e.pdf; DISTRIBUTOR-LINK: https://www.digikey.com/product-detail/en/murata-electronics-north-america/GRM188R71H103KA01D/490-1512-1-ND/587862; DISTRIBUTOR-PN: 490-1512-1-ND; NOTE: -; PN-ALTERNATIVE1: PN-ALTERNATIVE1; PN-ALTERNATIVE2: PN-ALTERNATIVE2; PN-ALTERNATIVE3: PN-ALTERNATIVE3; PN-ALTERNATIVE4: PN-ALTERNATIVE4; PN-ALTERNATIVE5: PN-ALTERNATIVE5
C9 = C-0603: SMD Capacitor; MANUFACTURER: Murata; MANUFACTURER-PN: GRM188R61E475KE11D; GateName_1: G$1; SymbolName_1: C; DeviceName: -0603; CODE-ARDUINO: 0458; LibraryName: Arduino-rcl; DeviceSetName: C; DATASHEET: http://www.murata.com/~/media/webrenewal/support/library/catalog/products/capacitor/mlcc/c02e.pdf; DISTRIBUTOR-LINK: http://www.digikey.com/product-search/en?keywords=490-7203-1-ND; DISTRIBUTOR-PN: 490-7203-1-ND; NOTE: -; PN-ALTERNATIVE1: PN-ALTERNATIVE1; PN-ALTERNATIVE2: PN-ALTERNATIVE2; PN-ALTERNATIVE3: PN-ALTERNATIVE3; PN-ALTERNATIVE4: PN-ALTERNATIVE4; PN-ALTERNATIVE5: PN-ALTERNATIVE5
C23 C24 = C-0603: SMD Capacitor; MANUFACTURER: Samsung; MANUFACTURER-PN: CL10C220JB8NNNC; GateName_1: G$1; SymbolName_1: C; DeviceName: -0603; CODE-ARDUINO: 0014; PN-ALTERNATIVE1: 0603N220J500CT; LibraryName: Arduino-rcl; DeviceSetName: C; DATASHEET: http://www.samsungsem.com/kr/support/product-search/mlcc/__icsFiles/afieldfile/2016/08/18/S_CL10C220JB8NNNC.pdf; DISTRIBUTOR-LINK: https://www.digikey.com/product-detail/en/samsung-electro-mechanics-america-inc/CL10C220JB8NNNC/1276-1023-1-ND/3889109; DISTRIBUTOR-PN: 1276-1023-1-ND; NOTE: -; PN-ALTERNATIVE2: PN-ALTERNATIVE2; PN-ALTERNATIVE3: PN-ALTERNATIVE3; PN-ALTERNATIVE4: PN-ALTERNATIVE4; PN-ALTERNATIVE5: PN-ALTERNATIVE5
CN2 = JTAG_CONNECTOR-DNP: 2x5 PASSO 1,27; GateName_1: G$1; DeviceName: -DNP; SymbolName_1: PINHEAD_2X05_127; LibraryName: Arduino-connectors; DeviceSetName: JTAG_CONNECTOR; CODE-ARDUINO: DNP; DATASHEET: DNP; DISTRIBUTOR-LINK: DNP; DISTRIBUTOR-PN: DNP; MANUFACTURER: DNP; MANUFACTURER-PN: DNP
D2 = SS24FL: as D1 on sheet ArduinoZeroV4.0_0; LibraryName: Arduino-diodes; DeviceSetName: SS24FL; DATASHEET: https://www.fairchildsemi.com/datasheets/SS/SS24FL.pdf; DISTRIBUTOR-LINK: https://www.digikey.com/product-detail/en/fairchild-on-semiconductor/SS24FL/SS24FLCT-ND/5305093; DISTRIBUTOR-PN: SS24FLCT-ND; MANUFACTURER-PN: SS24FL
ICSP = PINHD-2X03-ICSPTH: PIN HEADER; MANUFACTURER: Adam Tech; MANUFACTURER-PN: RSE2-1-06-SG-1; GateName_1: G$1; SymbolName_1: PINH-2X03-ICSP; DeviceName: TH; CODE-ARDUINO: 0119; LibraryName: Arduino-connectors; DeviceSetName: PINHD-2X03-ICSP; MISO: MISO; SCK: SCK; RESET: RESET; +5V: +5V; MOSI: MOSI; GND: GND; DATASHEET: DATASHEET; DISTRIBUTOR-LINK: DISTRIBUTOR-LINK; DISTRIBUTOR-PN: DISTRIBUTOR-PN
J1 = PINHD-1X18-CUSTOM_OLD: Pin header; GateName_1: A; CODE-ARDUINO: 3648; SymbolName_1: PINHD-1X18; DeviceName: -CUSTOM_OLD; LibraryName: Arduino-connectors; DeviceSetName: PINHD-1X18; DATASHEET: -; DISTRIBUTOR-LINK: -; DISTRIBUTOR-PN: -; MANUFACTURER-PN: -; MANUFCATURER: -; NOTE: -
J2 = PINHD-1X14-CUSTOM_OLD: PIN HEADER; GateName_1: A; CODE-ARDUINO: 3649; SymbolName_1: PINHD-1X14; DeviceName: -CUSTOM_OLD; LibraryName: Arduino-connectors; DeviceSetName: PINHD-1X14; DATASHEET: -; DISTRIBUTOR-LINK: -; DISTRIBUTOR-PN: -; MANUFACTURER: -; MANUFACTURER-PN: -; NOTE: -
L3 = FERRITE0805: SMD ferrite; MANUFACTURER: Murata; MANUFACTURER-PN: BLM21PG300SN1D; GateName_1: >NAME; DeviceName: 0805; CODE-ARDUINO: 0001; PN-ALTERNATIVE1: MH2029-300Y; SymbolName_1: FERRITE; LibraryName: Arduino-rcl; DeviceSetName: FERRITE; DATASHEET: https://www.murata.com/en-us/products/productdata/8796738977822/ENFA0005.pdf; DISTRIBUTOR-LINK: https://www.digikey.it/product-detail/en/murata-electronics-north-america/BLM21PG300SN1D/490-1052-1-ND/584499; DISTRIBUTOR-PN: 490-1052-1-ND
LED1-LED3 = LED-0805: LED; MANUFACTURER: Lite-On; MANUFACTURER-PN: LTST-C170YKT; GateName_1: G$1; DeviceName: -0805; CODE-ARDUINO: 0044; PN-ALTERNATIVE1: KPT-2012YC; SymbolName_1: LED; LibraryName: Arduino-diodes; DeviceSetName: LED; DATASHEET: https://media.digikey.com/pdf/Data%20Sheets/Lite-On%20PDFs/LTST-C170GKT.pdf; DISTRIBUTOR-LINK: https://www.digikey.com/product-detail/it/lite-on-inc/LTST-C170YKT/160-1175-1-ND/269247; DISTRIBUTOR-PN: 160-1175-1-ND
R1 R12 R13 = R-0603: as R10 on sheet ArduinoZeroV4.0_0; LibraryName: Arduino-rcl; DeviceSetName: R; DATASHEET: http://www.yageo.com/documents/recent/PYu-RC_Group_51_RoHS_L_8.pdf; DISTRIBUTOR-LINK: https://www.digikey.com/product-detail/en/yageo/RC0603JR-0710KL/311-10KGRCT-ND/729647; DISTRIBUTOR-PN: 311-10KGRCT-ND; PN-ALTERNATIVE1: -
R4 R38 = R-0603: as R11 on sheet ArduinoZeroV4.0_0; LibraryName: Arduino-rcl; DeviceSetName: R; DATASHEET: http://www.yageo.com/documents/recent/PYu-RC_Group_51_RoHS_L_10.pdf; DISTRIBUTOR-LINK: https://www.digikey.com/product-detail/en/yageo/RC0603FR-07330RL/311-330HRCT-ND/730109; DISTRIBUTOR-PN: 311-330HRCT-ND; PN-ALTERNATIVE1: -
R15 = 4R-NCAY16: Array Chip Resistor   Source: RS Component / Phycomp; MANUFACTURER: Bourns Inc.; MANUFACTURER-PN: CAY16-471J4LF; GateName_1: A; SymbolName_1: R1NV; GateName_2: B; GateName_3: C; GateName_4: D; DeviceSetName: 4R-N; CODE-ARDUINO: 0540; RESTRICTIONS: NO; SymbolName_2: R1NV; SymbolName_3: R1NV; SymbolName_4: R1NV; DeviceName: CAY16; LibraryName: Arduino-rcl; DATASHEET: http://www.bourns.com/docs/Product-Datasheets/CATCAY.pdf; DISTRIBUTOR-LINK: https://www.digikey.com/product-detail/en/bourns-inc/CAY16-471J4LF/CAY16-471J4LFCT-ND/3437962; DISTRIBUTOR-PN: CAY16-471J4LFCT-ND; PN-ALTERNATIVE1: PN-ALTERNATIVE1
RESET = TACTILE2: Pushbutton; MANUFACTURER: TE; MANUFACTURER-PN: FSM14JSMAS; GateName_1: G$1; SymbolName_1: TACTILE-5PINS; LibraryName: Arduino-pushbuttons; DeviceSetName: TACTILE2; CODE-ARDUINO: -; DATASHEET: http://www.te.com/commerce/DocumentDelivery/DDEController?Action=srchrtrv&DocNm=1977223&DocType=Customer+Drawing&DocLang=English; DISTRIBUTOR-LINK: https://www.digikey.com/product-detail/en/te-connectivity-alcoswitch-switches/FSM14JSMAS/450-2161-ND/5343810; DISTRIBUTOR-PN: 450-2161-ND; PN-ALTERNATIVE1: PN-ALTERNATIVE1
TR3 = 2N7002T-SOT23: MOSFET N-CH 60V 115MA; MANUFACTURER: Micro Commercial Co; MANUFACTURER-PN: 2N7002-TP; GateName_1: G$1; SymbolName_1: N-MOS-1; DeviceName: -SOT23; CODE-ARDUINO: 1612; LibraryName: Arduino-transistors; DeviceSetName: 2N7002T; DATASHEET: http://www.mccsemi.com/up_pdf/2N7002(SOT-23).PDF; DISTRIBUTOR-LINK: https://www.digikey.com/product-detail/it/micro-commercial-co/2N7002-TP/2N7002-TPMSCT-ND/1960099; DISTRIBUTOR-PN: 2N7002-TPMSCT-ND
U1 = ATSAMD21G18A-48QFN: ARMÂ® CortexÂ®-M0+ SAM D21G Microcontroller IC 32-Bit 48MHz 256KB (256K x 8) FLASH 48-TQFP (7x7); GateName_1: A; SymbolName_1: ATSAMD21G18A-48-A; GateName_2: B; SymbolName_2: ATSAMD21G18A-48-B; DeviceName: QFN; CODE-ARDUINO: DNP; LibraryName: Arduino-ucs&SoCs; DeviceSetName: ATSAMD21G18A-48; DATASHEET: DNP; DISTRIBUTOR-LINK: DNP; DISTRIBUTOR-PN: DNP; MANUFACTURER: DNP; MANUFACTURER-PN: DNP
Y4 = 32.768KHZ: LF crystal; MANUFACTURER: Abracon LLC; MANUFACTURER-PN: ABS07-32.768KHZ-T; GateName_1: G$1; SymbolName_1: Q; CODE-ARDUINO: 0213; LibraryName: Arduino-crystals; DeviceSetName: 32.768KHZ; 1: 1; 2: 2; DATASHEET: http://www.abracon.com/Resonators/ABS07.pdf; DISTRIBUTOR-LINK: http://www.digikey.com/product-detail/en/abracon-llc/ABS07-32.768KHZ-T/535-9542-1-ND/1237009; DISTRIBUTOR-PN: 535-9542-1-ND

## Nets that join several sheets
+3V3: ArduinoZeroV4.0_0 (5 pins), ArduinoZeroV4.0_1 (17 pins)
+5V: ArduinoZeroV4.0_0 (8 pins), ArduinoZeroV4.0_1 (ICSP.2 J2.5)
GND: ArduinoZeroV4.0_0 (21 pins), ArduinoZeroV4.0_1 (25 pins)